# Altium schematic sheet LED20-A1-P02.SchDoc
size A3
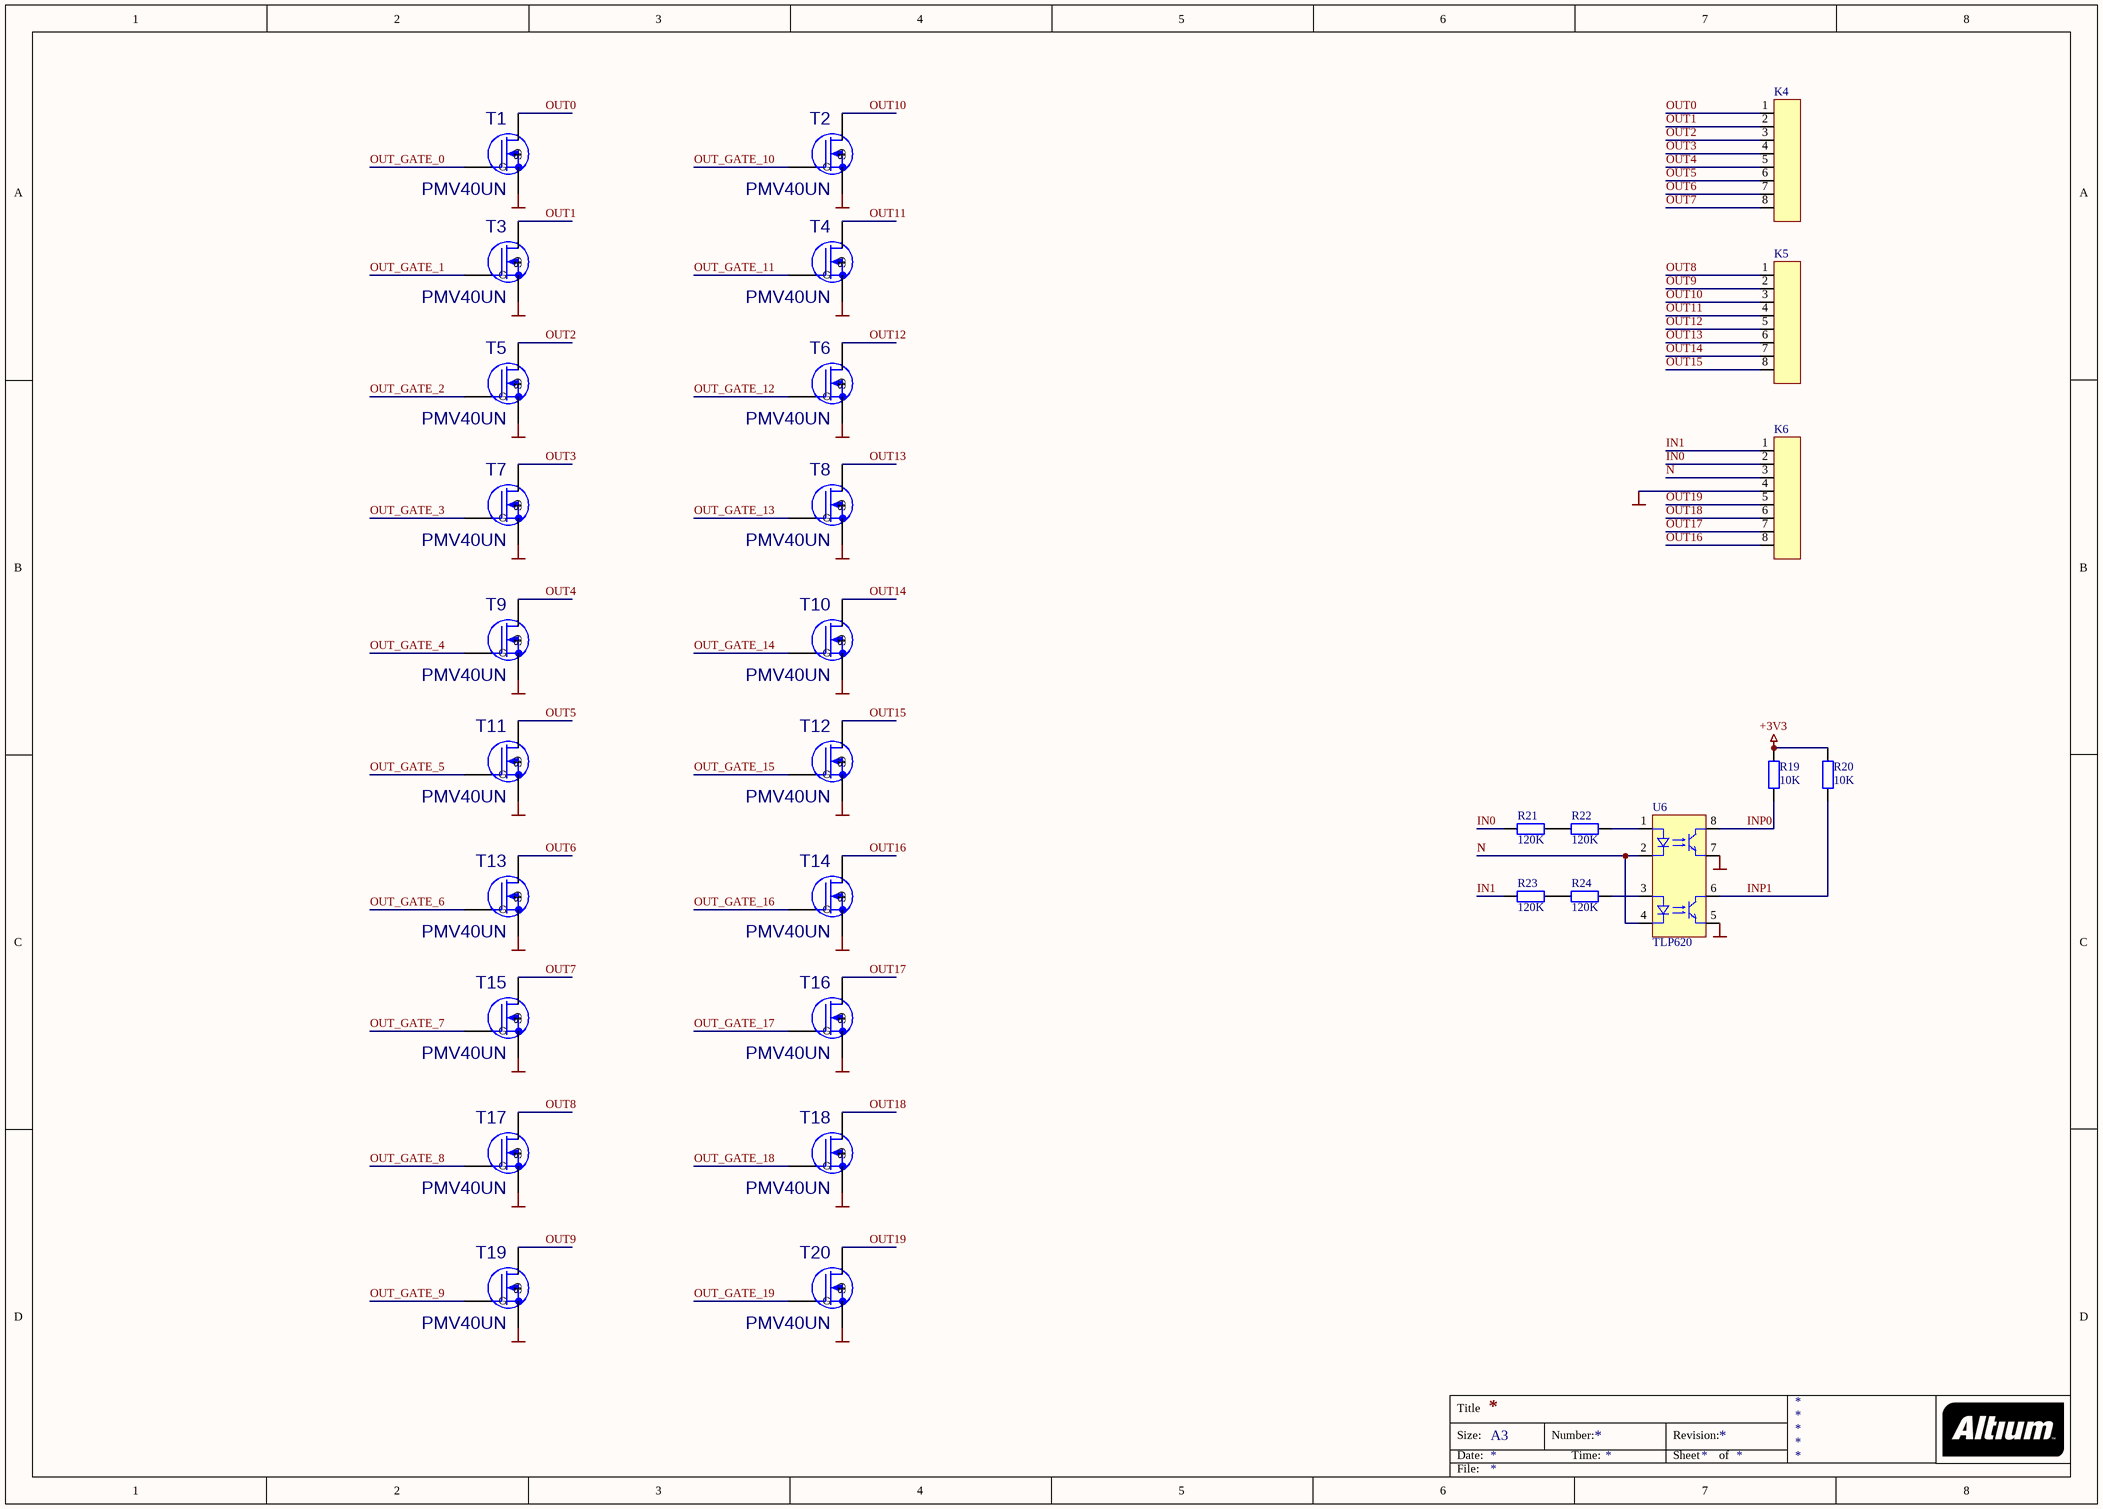
[diagram p0: LED20-A1-P02.SchDoc]

## Parts
K4  Terminal Block Connector, 3.81mm, Right Angle  [CONN_3.81_8]  (value not drawn)
K5  Terminal Block Connector, 3.81mm, Right Angle  [CONN_3.81_8]  (value not drawn)
K6  Terminal Block Connector, 3.81mm, Right Angle  [CONN_3.81_8]  (value not drawn)
R19  10K  [RC0805-1]
R20  10K  [RC0805-1]
R21  120K  [RC1206-1]
R22  120K  [RC1206-1]
R23  120K  [RC1206-1]
R24  120K  [RC1206-1]
T1  PMV40UN  [SOT-23]
T2  PMV40UN  [SOT-23]
T3  PMV40UN  [SOT-23]
T4  PMV40UN  [SOT-23]
T5  PMV40UN  [SOT-23]
T6  PMV40UN  [SOT-23]
T7  PMV40UN  [SOT-23]
T8  PMV40UN  [SOT-23]
T9  PMV40UN  [SOT-23]
T10  PMV40UN  [SOT-23]
T11  PMV40UN  [SOT-23]
T12  PMV40UN  [SOT-23]
T13  PMV40UN  [SOT-23]
T14  PMV40UN  [SOT-23]
T15  PMV40UN  [SOT-23]
T16  PMV40UN  [SOT-23]
T17  PMV40UN  [SOT-23]
T18  PMV40UN  [SOT-23]
T19  PMV40UN  [SOT-23]
T20  PMV40UN  [SOT-23]
U6  TLP620  [DIP8]

## Nets
+3V3: R19.1 R20.1
GND: K6.4(K) T1.2(S) T2.2(S) T3.2(S) T4.2(S) T5.2(S) T6.2(S) T7.2(S) T8.2(S) T9.2(S) T10.2(S) T11.2(S) T12.2(S) T13.2(S) T14.2(S) T15.2(S) T16.2(S) T17.2(S) T18.2(S) T19.2(S) T20.2(S) U6.5(E) U6.7(E)
IN0: K6.2(K) R21.1
IN1: K6.1(A) R23.1
INP0: R19.2 U6.8(C)
INP1: R20.2 U6.6(C)
N: K6.3(A) U6.2(K) U6.4(K)
OUT0: K4.1(A) T1.3(D)
OUT1: K4.2(K) T3.3(D)
OUT2: K4.3(A) T5.3(D)
OUT3: K4.4(K) T7.3(D)
OUT4: K4.5(E) T9.3(D)
OUT5: K4.6(C) T11.3(D)
OUT6: K4.7(E) T13.3(D)
OUT7: K4.8(C) T15.3(D)
OUT8: K5.1(A) T17.3(D)
OUT9: K5.2(K) T19.3(D)
OUT10: K5.3(A) T2.3(D)
OUT11: K5.4(K) T4.3(D)
OUT12: K5.5(E) T6.3(D)
OUT13: K5.6(C) T8.3(D)
OUT14: K5.7(E) T10.3(D)
OUT15: K5.8(C) T12.3(D)
OUT16: K6.8(C) T14.3(D)
OUT17: K6.7(E) T16.3(D)
OUT18: K6.6(C) T18.3(D)
OUT19: K6.5(E) T20.3(D)
OUT_GATE_0: T1.1(G)
OUT_GATE_1: T3.1(G)
OUT_GATE_2: T5.1(G)
OUT_GATE_3: T7.1(G)
OUT_GATE_4: T9.1(G)
OUT_GATE_5: T11.1(G)
OUT_GATE_6: T13.1(G)
OUT_GATE_7: T15.1(G)
OUT_GATE_8: T17.1(G)
OUT_GATE_9: T19.1(G)
OUT_GATE_10: T2.1(G)
OUT_GATE_11: T4.1(G)
OUT_GATE_12: T6.1(G)
OUT_GATE_13: T8.1(G)
OUT_GATE_14: T10.1(G)
OUT_GATE_15: T12.1(G)
OUT_GATE_16: T14.1(G)
OUT_GATE_17: T16.1(G)
OUT_GATE_18: T18.1(G)
OUT_GATE_19: T20.1(G)
NetR21_2: R21.2 R22.1
NetR22_2: R22.2 U6.1(A)
NetR23_2: R23.2 R24.1
NetR24_2: R24.2 U6.3(A)

## Notes on the sheet
- Title
- Size:
- Date:
- A3
- Number:
- Time:
- Revision:
- Sheet
- of
- File:

## Library data of the parts
K4-K6 = CONN_TB_3.81_8PIN: Terminal Block Connector, 3.81mm, 8pin
R19 R20 = RES0805: Chip Resistor 0805; Comment2: 0.125W 1% 200ppm; Sort: 110; Tech: SMDR; Package: Res Chip 0805; Price: 0.002
R21-R24 = RES1206: Chip Resistor 1206; Comment2: 0.25W 1% 200ppm; Sort: 110; Tech: SMDR; Package: Res Chip 1206; Price: 0.002
U6 = TLP620: digital temperature sensor
T1-T20 = PMV40UN: Value: *